# EAGLE design pcb (EAGLE 9.6.2)
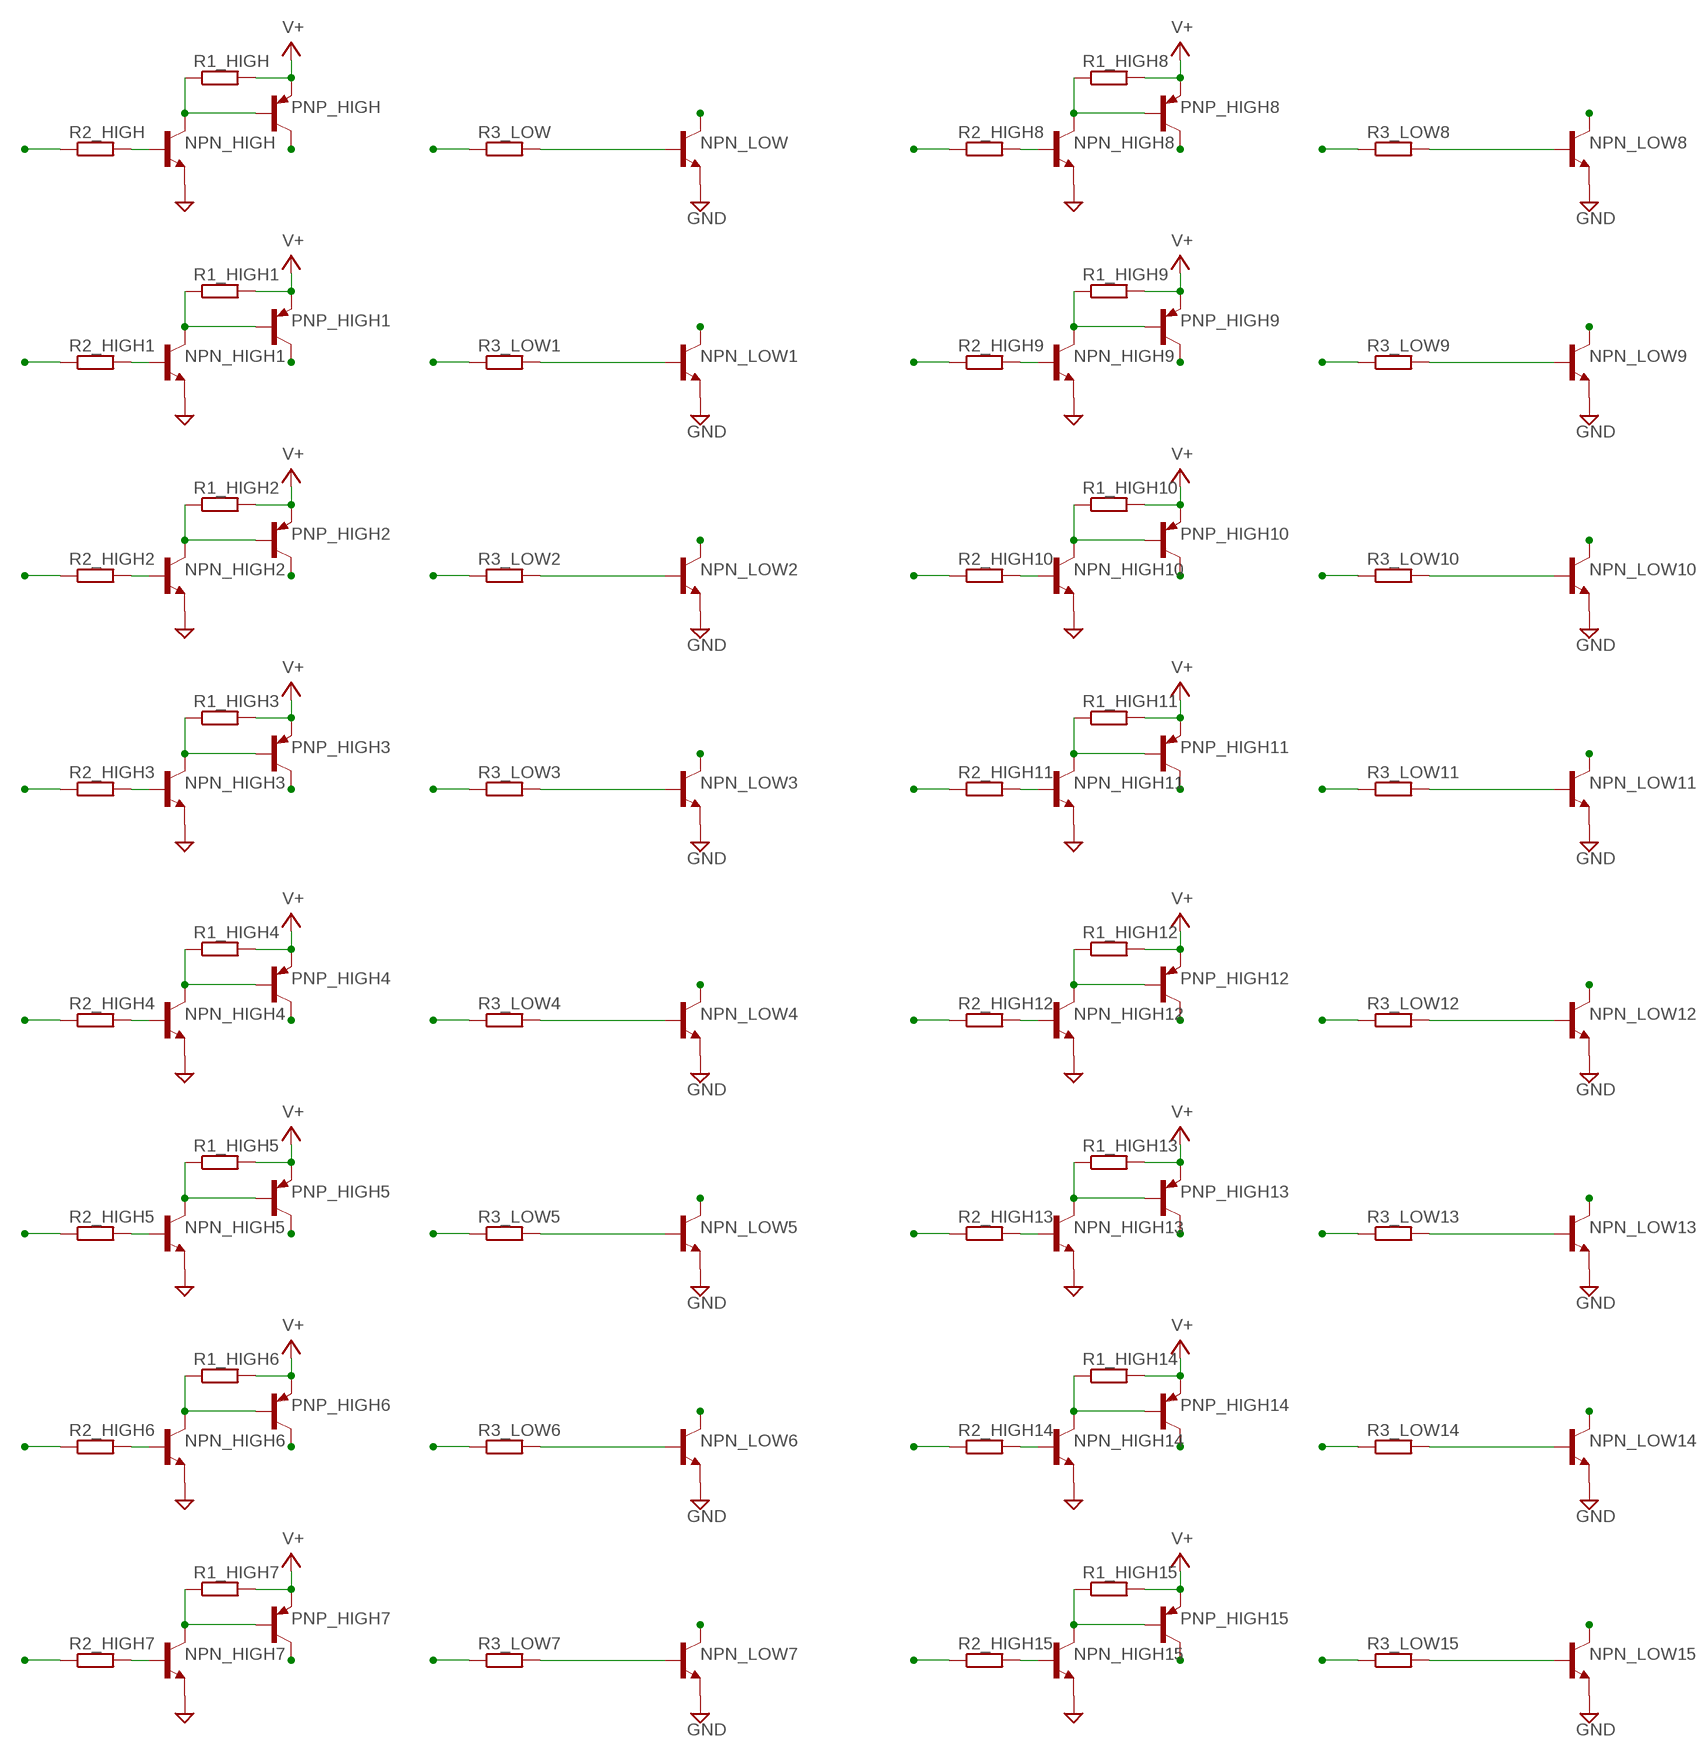
[diagram p0: schematic, sheet 1]

## Parts
NPN_HIGH  -NPN-TO92-ECB  [TO92-ECB]
NPN_HIGH1  -NPN-TO92-ECB  [TO92-ECB]
NPN_HIGH2  -NPN-TO92-ECB  [TO92-ECB]
NPN_HIGH3  -NPN-TO92-ECB  [TO92-ECB]
NPN_HIGH4  -NPN-TO92-ECB  [TO92-ECB]
NPN_HIGH5  -NPN-TO92-ECB  [TO92-ECB]
NPN_HIGH6  -NPN-TO92-ECB  [TO92-ECB]
NPN_HIGH7  -NPN-TO92-ECB  [TO92-ECB]
NPN_HIGH8  -NPN-TO92-ECB  [TO92-ECB]
NPN_HIGH9  -NPN-TO92-ECB  [TO92-ECB]
NPN_HIGH10  -NPN-TO92-ECB  [TO92-ECB]
NPN_HIGH11  -NPN-TO92-ECB  [TO92-ECB]
NPN_HIGH12  -NPN-TO92-ECB  [TO92-ECB]
NPN_HIGH13  -NPN-TO92-ECB  [TO92-ECB]
NPN_HIGH14  -NPN-TO92-ECB  [TO92-ECB]
NPN_HIGH15  -NPN-TO92-ECB  [TO92-ECB]
NPN_LOW  -NPN-TO92-ECB  [TO92-ECB]
NPN_LOW1  -NPN-TO92-ECB  [TO92-ECB]
NPN_LOW2  -NPN-TO92-ECB  [TO92-ECB]
NPN_LOW3  -NPN-TO92-ECB  [TO92-ECB]
NPN_LOW4  -NPN-TO92-ECB  [TO92-ECB]
NPN_LOW5  -NPN-TO92-ECB  [TO92-ECB]
NPN_LOW6  -NPN-TO92-ECB  [TO92-ECB]
NPN_LOW7  -NPN-TO92-ECB  [TO92-ECB]
NPN_LOW8  -NPN-TO92-ECB  [TO92-ECB]
NPN_LOW9  -NPN-TO92-ECB  [TO92-ECB]
NPN_LOW10  -NPN-TO92-ECB  [TO92-ECB]
NPN_LOW11  -NPN-TO92-ECB  [TO92-ECB]
NPN_LOW12  -NPN-TO92-ECB  [TO92-ECB]
NPN_LOW13  -NPN-TO92-ECB  [TO92-ECB]
NPN_LOW14  -NPN-TO92-ECB  [TO92-ECB]
NPN_LOW15  -NPN-TO92-ECB  [TO92-ECB]
PNP_HIGH  -PNP-TO92-BEC  [TO92-BEC]
PNP_HIGH1  -PNP-TO92-BEC  [TO92-BEC]
PNP_HIGH2  -PNP-TO92-BEC  [TO92-BEC]
PNP_HIGH3  -PNP-TO92-BEC  [TO92-BEC]
PNP_HIGH4  -PNP-TO92-BEC  [TO92-BEC]
PNP_HIGH5  -PNP-TO92-BEC  [TO92-BEC]
PNP_HIGH6  -PNP-TO92-BEC  [TO92-BEC]
PNP_HIGH7  -PNP-TO92-BEC  [TO92-BEC]
PNP_HIGH8  -PNP-TO92-BEC  [TO92-BEC]
PNP_HIGH9  -PNP-TO92-BEC  [TO92-BEC]
PNP_HIGH10  -PNP-TO92-BEC  [TO92-BEC]
PNP_HIGH11  -PNP-TO92-BEC  [TO92-BEC]
PNP_HIGH12  -PNP-TO92-BEC  [TO92-BEC]
PNP_HIGH13  -PNP-TO92-BEC  [TO92-BEC]
PNP_HIGH14  -PNP-TO92-BEC  [TO92-BEC]
PNP_HIGH15  -PNP-TO92-BEC  [TO92-BEC]
R1_HIGH  R-EU_0613/15  [P0613/15]
R1_HIGH1  R-EU_0613/15  [P0613/15]
R1_HIGH2  R-EU_0613/15  [P0613/15]
R1_HIGH3  R-EU_0613/15  [P0613/15]
R1_HIGH4  R-EU_0613/15  [P0613/15]
R1_HIGH5  R-EU_0613/15  [P0613/15]
R1_HIGH6  R-EU_0613/15  [P0613/15]
R1_HIGH7  R-EU_0613/15  [P0613/15]
R1_HIGH8  R-EU_0613/15  [P0613/15]
R1_HIGH9  R-EU_0613/15  [P0613/15]
R1_HIGH10  R-EU_0613/15  [P0613/15]
R1_HIGH11  R-EU_0613/15  [P0613/15]
R1_HIGH12  R-EU_0613/15  [P0613/15]
R1_HIGH13  R-EU_0613/15  [P0613/15]
R1_HIGH14  R-EU_0613/15  [P0613/15]
R1_HIGH15  R-EU_0613/15  [P0613/15]
R2_HIGH  R-EU_0613/15  [P0613/15]
R2_HIGH1  R-EU_0613/15  [P0613/15]
R2_HIGH2  R-EU_0613/15  [P0613/15]
R2_HIGH3  R-EU_0613/15  [P0613/15]
R2_HIGH4  R-EU_0613/15  [P0613/15]
R2_HIGH5  R-EU_0613/15  [P0613/15]
R2_HIGH6  R-EU_0613/15  [P0613/15]
R2_HIGH7  R-EU_0613/15  [P0613/15]
R2_HIGH8  R-EU_0613/15  [P0613/15]
R2_HIGH9  R-EU_0613/15  [P0613/15]
R2_HIGH10  R-EU_0613/15  [P0613/15]
R2_HIGH11  R-EU_0613/15  [P0613/15]
R2_HIGH12  R-EU_0613/15  [P0613/15]
R2_HIGH13  R-EU_0613/15  [P0613/15]
R2_HIGH14  R-EU_0613/15  [P0613/15]
R2_HIGH15  R-EU_0613/15  [P0613/15]
R3_LOW  R-EU_0613/15  [P0613/15]
R3_LOW1  R-EU_0613/15  [P0613/15]
R3_LOW2  R-EU_0613/15  [P0613/15]
R3_LOW3  R-EU_0613/15  [P0613/15]
R3_LOW4  R-EU_0613/15  [P0613/15]
R3_LOW5  R-EU_0613/15  [P0613/15]
R3_LOW6  R-EU_0613/15  [P0613/15]
R3_LOW7  R-EU_0613/15  [P0613/15]
R3_LOW8  R-EU_0613/15  [P0613/15]
R3_LOW9  R-EU_0613/15  [P0613/15]
R3_LOW10  R-EU_0613/15  [P0613/15]
R3_LOW11  R-EU_0613/15  [P0613/15]
R3_LOW12  R-EU_0613/15  [P0613/15]
R3_LOW13  R-EU_0613/15  [P0613/15]
R3_LOW14  R-EU_0613/15  [P0613/15]
R3_LOW15  R-EU_0613/15  [P0613/15]

## Nets
GND: NPN_HIGH1.E NPN_HIGH2.E NPN_HIGH3.E NPN_HIGH4.E NPN_HIGH5.E NPN_HIGH6.E NPN_HIGH7.E NPN_HIGH8.E NPN_HIGH9.E NPN_HIGH10.E NPN_HIGH11.E NPN_HIGH12.E NPN_HIGH13.E NPN_HIGH14.E NPN_HIGH15.E NPN_HIGH.E NPN_LOW1.E NPN_LOW2.E NPN_LOW3.E NPN_LOW4.E NPN_LOW5.E NPN_LOW6.E NPN_LOW7.E NPN_LOW8.E NPN_LOW9.E NPN_LOW10.E NPN_LOW11.E NPN_LOW12.E NPN_LOW13.E NPN_LOW14.E NPN_LOW15.E NPN_LOW.E
N$1: R2_HIGH.1
N$2: NPN_HIGH.B R2_HIGH.2
N$3: NPN_HIGH.C PNP_HIGH.B R1_HIGH.1
N$4: PNP_HIGH.C
N$5: NPN_LOW.B R3_LOW.2
N$6: NPN_LOW.C
N$7: R3_LOW.1
N$8: R2_HIGH1.1
N$9: NPN_HIGH1.B R2_HIGH1.2
N$10: NPN_HIGH1.C PNP_HIGH1.B R1_HIGH1.1
N$11: PNP_HIGH1.C
N$12: NPN_LOW1.B R3_LOW1.2
N$13: R3_LOW1.1
N$14: NPN_LOW1.C
N$15: R2_HIGH2.1
N$16: NPN_HIGH2.B R2_HIGH2.2
N$17: NPN_HIGH2.C PNP_HIGH2.B R1_HIGH2.1
N$18: PNP_HIGH2.C
N$19: NPN_LOW2.B R3_LOW2.2
N$20: R3_LOW2.1
N$21: NPN_LOW2.C
N$22: R2_HIGH3.1
N$23: NPN_HIGH3.B R2_HIGH3.2
N$24: NPN_HIGH3.C PNP_HIGH3.B R1_HIGH3.1
N$25: PNP_HIGH3.C
N$26: NPN_LOW3.B R3_LOW3.2
N$27: R3_LOW3.1
N$28: NPN_LOW3.C
N$29: R2_HIGH4.1
N$30: NPN_HIGH4.B R2_HIGH4.2
N$31: NPN_HIGH4.C PNP_HIGH4.B R1_HIGH4.1
N$32: PNP_HIGH4.C
N$33: NPN_LOW4.B R3_LOW4.2
N$34: R3_LOW4.1
N$35: NPN_LOW4.C
N$36: R2_HIGH5.1
N$37: NPN_HIGH5.B R2_HIGH5.2
N$38: NPN_HIGH5.C PNP_HIGH5.B R1_HIGH5.1
N$39: PNP_HIGH5.C
N$40: NPN_LOW5.B R3_LOW5.2
N$41: R3_LOW5.1
N$42: NPN_LOW5.C
N$43: R2_HIGH6.1
N$44: NPN_HIGH6.B R2_HIGH6.2
N$45: NPN_HIGH6.C PNP_HIGH6.B R1_HIGH6.1
N$46: PNP_HIGH6.C
N$47: NPN_LOW6.B R3_LOW6.2
N$48: R3_LOW6.1
N$49: NPN_LOW6.C
N$50: R2_HIGH7.1
N$51: NPN_HIGH7.B R2_HIGH7.2
N$52: NPN_HIGH7.C PNP_HIGH7.B R1_HIGH7.1
N$53: PNP_HIGH7.C
N$54: NPN_LOW7.B R3_LOW7.2
N$55: R3_LOW7.1
N$56: NPN_LOW7.C
N$57: R2_HIGH8.1
N$58: NPN_HIGH8.B R2_HIGH8.2
N$59: NPN_HIGH8.C PNP_HIGH8.B R1_HIGH8.1
N$60: PNP_HIGH8.C
N$61: NPN_LOW8.B R3_LOW8.2
N$62: R3_LOW8.1
N$63: NPN_LOW8.C
N$64: R2_HIGH9.1
N$65: NPN_HIGH9.B R2_HIGH9.2
N$66: NPN_HIGH9.C PNP_HIGH9.B R1_HIGH9.1
N$67: PNP_HIGH9.C
N$68: NPN_LOW9.B R3_LOW9.2
N$69: R3_LOW9.1
N$70: NPN_LOW9.C
N$71: R2_HIGH10.1
N$72: NPN_HIGH10.B R2_HIGH10.2
N$73: NPN_HIGH10.C PNP_HIGH10.B R1_HIGH10.1
N$74: PNP_HIGH10.C
N$75: NPN_LOW10.B R3_LOW10.2
N$76: R3_LOW10.1
N$77: NPN_LOW10.C
N$78: R2_HIGH11.1
N$79: NPN_HIGH11.B R2_HIGH11.2
N$80: NPN_HIGH11.C PNP_HIGH11.B R1_HIGH11.1
N$81: PNP_HIGH11.C
N$82: NPN_LOW11.B R3_LOW11.2
N$83: R3_LOW11.1
N$84: NPN_LOW11.C
N$85: R2_HIGH12.1
N$86: NPN_HIGH12.B R2_HIGH12.2
N$87: NPN_HIGH12.C PNP_HIGH12.B R1_HIGH12.1
N$88: PNP_HIGH12.C
N$89: NPN_LOW12.B R3_LOW12.2
N$90: R3_LOW12.1
N$91: NPN_LOW12.C
N$92: R2_HIGH13.1
N$93: NPN_HIGH13.B R2_HIGH13.2
N$94: NPN_HIGH13.C PNP_HIGH13.B R1_HIGH13.1
N$95: PNP_HIGH13.C
N$96: NPN_LOW13.B R3_LOW13.2
N$97: R3_LOW13.1
N$98: NPN_LOW13.C
N$99: R2_HIGH14.1
N$100: NPN_HIGH14.B R2_HIGH14.2
N$101: NPN_HIGH14.C PNP_HIGH14.B R1_HIGH14.1
N$102: PNP_HIGH14.C
N$103: NPN_LOW14.B R3_LOW14.2
N$104: R3_LOW14.1
N$105: NPN_LOW14.C
N$106: R2_HIGH15.1
N$107: NPN_HIGH15.B R2_HIGH15.2
N$108: NPN_HIGH15.C PNP_HIGH15.B R1_HIGH15.1
N$109: PNP_HIGH15.C
N$110: NPN_LOW15.B R3_LOW15.2
N$111: R3_LOW15.1
N$112: NPN_LOW15.C
V+: PNP_HIGH1.E PNP_HIGH2.E PNP_HIGH3.E PNP_HIGH4.E PNP_HIGH5.E PNP_HIGH6.E PNP_HIGH7.E PNP_HIGH8.E PNP_HIGH9.E PNP_HIGH10.E PNP_HIGH11.E PNP_HIGH12.E PNP_HIGH13.E PNP_HIGH14.E PNP_HIGH15.E PNP_HIGH.E R1_HIGH1.2 R1_HIGH2.2 R1_HIGH3.2 R1_HIGH4.2 R1_HIGH5.2 R1_HIGH6.2 R1_HIGH7.2 R1_HIGH8.2 R1_HIGH9.2 R1_HIGH10.2 R1_HIGH11.2 R1_HIGH12.2 R1_HIGH13.2 R1_HIGH14.2 R1_HIGH15.2 R1_HIGH.2

## Library data of the parts
NPN_HIGH NPN_HIGH1-NPN_HIGH15 NPN_LOW NPN_LOW1-NPN_LOW15 = transistor:*-NPN-: NPN Transistror BF959 corrected 2008.03.06
PNP_HIGH PNP_HIGH1-PNP_HIGH15 = transistor:*-PNP-: PNP Transistror
R1_HIGH R1_HIGH1-R1_HIGH15 R2_HIGH R2_HIGH1-R2_HIGH15 R3_LOW R3_LOW1-R3_LOW15 = rcl:R-EU_: RESISTOR, European symbol; SPICEPREFIX: R

## Board
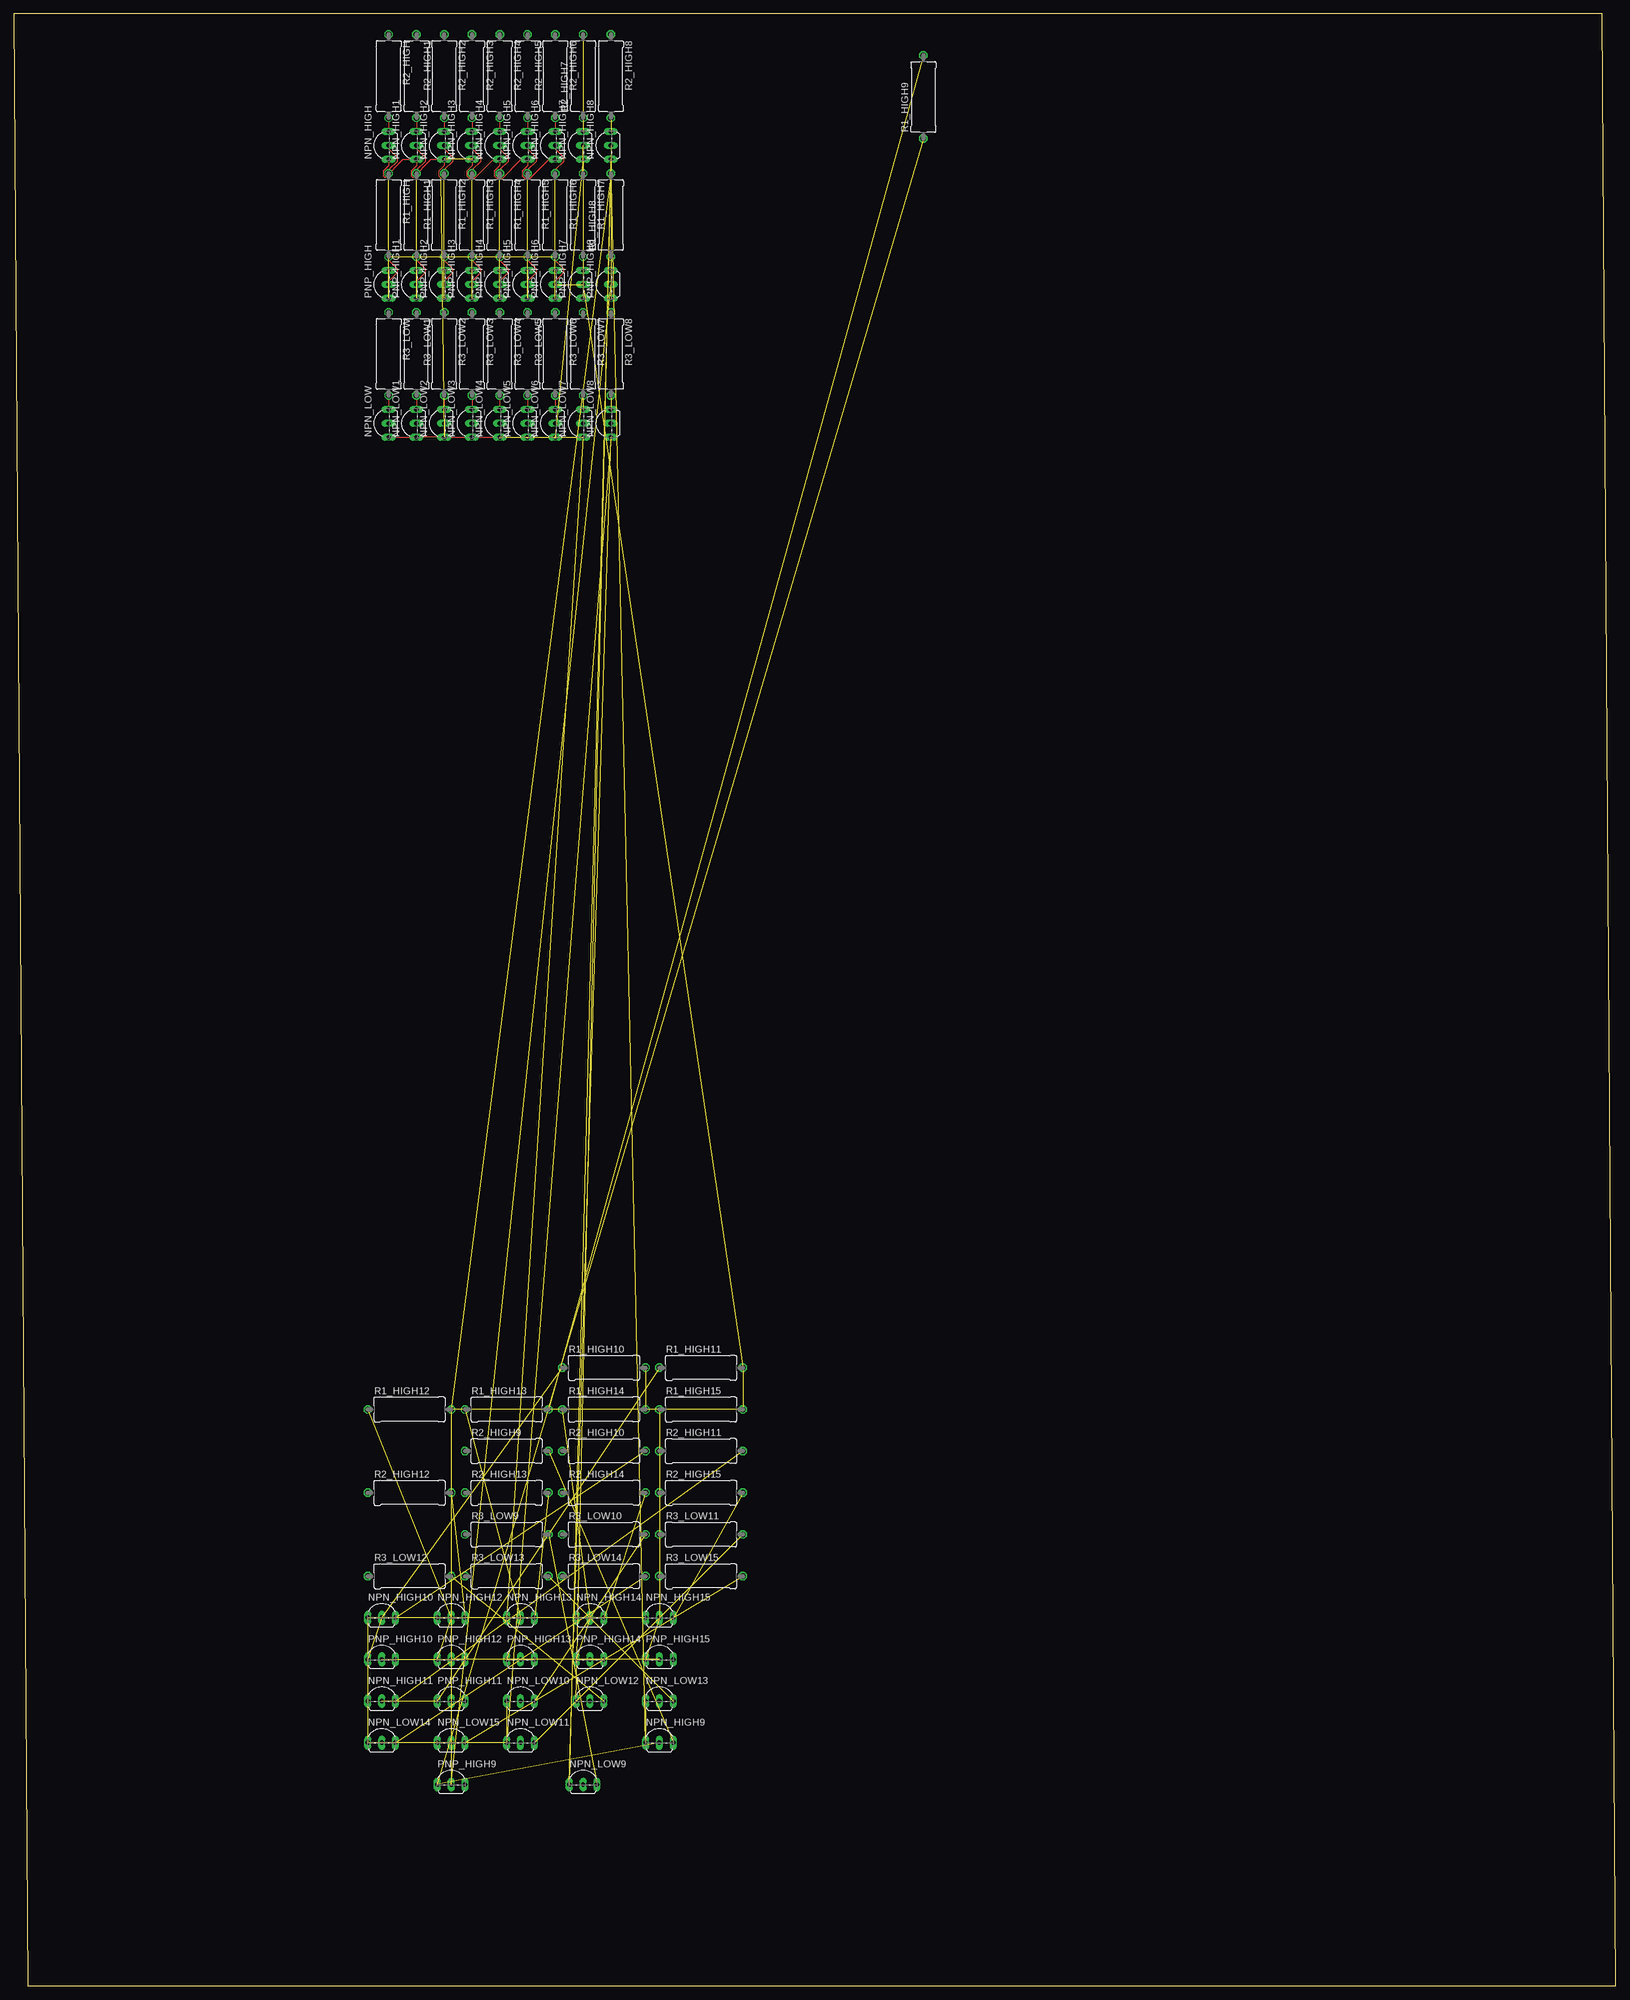
[diagram p1: board, top side]

Size 293.04 x 360.67 mm. Coordinates in mm from the lower left corner, seen from the top.
Outline: 2.54,0 293.04,0 290.5,360.67 0,360.67 2.54,0
Copper layers (1*16): Top 0.035mm / dielectric 1.5mm / Bottom 0.035mm
Design rules "default": minimum track width 6mil, minimum drill 0.35mm, track to track 6mil, track to pad 6mil, pad to pad 6mil, via to via 6mil, smd to smd 6mil, copper to edge 40mil, drill to drill 6mil, minimum pad ring 10mil, minimum via ring 8mil, stop-mask expansion 4mil, vias tented up to drill 0mil, thermal gap 10mil

### Footprints (pad centres in the part's own frame; a part is rotated, then mirrored left to right if it is on the bottom)
TO92-ECB = drill 0.813 long: B 2.54,0; C 0,0; E -2.54,0
TO92-BEC = drill 0.813 long: B -2.54,0; C 2.54,0; E 0,0
P0613/15 = drill 1.016 octagon: 1 -7.62,0; 2 7.62,0

### Placement (x,y rotation side)
NPN_HIGH  68.58,336.55 90 top
NPN_HIGH1  73.66,336.55 90 top
NPN_HIGH2  78.74,336.55 90 top
NPN_HIGH3  83.82,336.55 90 top
NPN_HIGH4  88.9,336.55 90 top
NPN_HIGH5  93.98,336.55 90 top
NPN_HIGH6  99.06,336.55 90 top
NPN_HIGH7  104.14,336.55 90 top
NPN_HIGH8  109.22,336.55 90 top
NPN_HIGH9  118.11,44.45 0 top
NPN_HIGH10  67.31,67.31 0 top
NPN_HIGH11  67.31,52.07 0 top
NPN_HIGH12  80.01,67.31 0 top
NPN_HIGH13  92.71,67.31 0 top
NPN_HIGH14  105.41,67.31 0 top
NPN_HIGH15  118.11,67.31 0 top
NPN_LOW  68.58,285.75 90 top
NPN_LOW1  73.66,285.75 90 top
NPN_LOW2  78.74,285.75 90 top
NPN_LOW3  83.82,285.75 90 top
NPN_LOW4  88.9,285.75 90 top
NPN_LOW5  93.98,285.75 90 top
NPN_LOW6  99.06,285.75 90 top
NPN_LOW7  104.14,285.75 90 top
NPN_LOW8  109.22,285.75 90 top
NPN_LOW9  104.14,36.83 0 top
NPN_LOW10  92.71,52.07 0 top
NPN_LOW11  92.71,44.45 0 top
NPN_LOW12  105.41,52.07 0 top
NPN_LOW13  118.11,52.07 0 top
NPN_LOW14  67.31,44.45 0 top
NPN_LOW15  80.01,44.45 0 top
PNP_HIGH  68.58,311.15 90 top
PNP_HIGH1  73.66,311.15 90 top
PNP_HIGH2  78.74,311.15 90 top
PNP_HIGH3  83.82,311.15 90 top
PNP_HIGH4  88.9,311.15 90 top
PNP_HIGH5  93.98,311.15 90 top
PNP_HIGH6  99.06,311.15 90 top
PNP_HIGH7  104.14,311.15 90 top
PNP_HIGH8  109.22,311.15 90 top
PNP_HIGH9  80.01,36.83 0 top
PNP_HIGH10  67.31,59.69 0 top
PNP_HIGH11  80.01,52.07 0 top
PNP_HIGH12  80.01,59.69 0 top
PNP_HIGH13  92.71,59.69 0 top
PNP_HIGH14  105.41,59.69 0 top
PNP_HIGH15  118.11,59.69 0 top
R1_HIGH  68.58,323.85 270 top
R1_HIGH1  73.66,323.85 270 top
R1_HIGH2  78.74,323.85 270 top
R1_HIGH3  83.82,323.85 270 top
R1_HIGH4  88.9,323.85 270 top
R1_HIGH5  93.98,323.85 270 top
R1_HIGH6  99.06,323.85 270 top
R1_HIGH7  104.14,323.85 270 top
R1_HIGH8  109.22,323.85 90 top
R1_HIGH9  166.37,345.44 90 top
R1_HIGH10  107.95,113.03 0 top
R1_HIGH11  125.73,113.03 0 top
R1_HIGH12  72.39,105.41 0 top
R1_HIGH13  90.17,105.41 0 top
R1_HIGH14  107.95,105.41 0 top
R1_HIGH15  125.73,105.41 0 top
R2_HIGH  68.58,349.25 270 top
R2_HIGH1  73.66,349.25 270 top
R2_HIGH2  78.74,349.25 270 top
R2_HIGH3  83.82,349.25 270 top
R2_HIGH4  88.9,349.25 270 top
R2_HIGH5  93.98,349.25 270 top
R2_HIGH6  99.06,349.25 270 top
R2_HIGH7  104.14,349.25 90 top
R2_HIGH8  109.22,349.25 270 top
R2_HIGH9  90.17,97.79 0 top
R2_HIGH10  107.95,97.79 0 top
R2_HIGH11  125.73,97.79 0 top
R2_HIGH12  72.39,90.17 0 top
R2_HIGH13  90.17,90.17 0 top
R2_HIGH14  107.95,90.17 0 top
R2_HIGH15  125.73,90.17 0 top
R3_LOW  68.58,298.45 270 top
R3_LOW1  73.66,298.45 270 top
R3_LOW2  78.74,298.45 270 top
R3_LOW3  83.82,298.45 270 top
R3_LOW4  88.9,298.45 270 top
R3_LOW5  93.98,298.45 270 top
R3_LOW6  99.06,298.45 270 top
R3_LOW7  104.14,298.45 270 top
R3_LOW8  109.22,298.45 270 top
R3_LOW9  90.17,82.55 0 top
R3_LOW10  107.95,82.55 0 top
R3_LOW11  125.73,82.55 0 top
R3_LOW12  72.39,74.93 0 top
R3_LOW13  90.17,74.93 0 top
R3_LOW14  107.95,74.93 0 top
R3_LOW15  125.73,74.93 0 top

### Tracks (layer width: path | path; a pad name or v marks a point on that pad's centre or on a via)
GND  (20 unrouted)
  Top 0.152: NPN_LOW.E NPN_LOW1.E NPN_LOW2.E NPN_LOW3.E NPN_LOW4.E NPN_LOW5.E NPN_LOW6.E | NPN_HIGH.E 68.58,332.87 67.59,331.88 67.59,331.06 67.94,330.7 71.25,334.01 NPN_HIGH1.E 73.66,332.87 72.67,331.88 72.67,331.06 73.03,330.7 76.33,334.01 NPN_HIGH2.E 78.74,332.87 77.75,331.88 77.75,331.06 78.11,330.7 | NPN_HIGH3.E 83.82,332.87 82.83,331.88 82.83,331.06 83.41,330.48 84.23,330.48 87.76,334.01 NPN_HIGH4.E 88.9,332.87 87.91,331.88 87.91,331.06 88.49,330.48 89.31,330.48 92.84,334.01 NPN_HIGH5.E 93.98,332.87 92.99,331.88 92.99,331.06 93.57,330.48 94.39,330.48 97.92,334.01 NPN_HIGH6.E
N$2
  Top 0.152: R2_HIGH.2 NPN_HIGH.B
N$3  (1 unrouted)
  Top 0.152: NPN_HIGH.C 68.58,335.93 70.13,334.38 70.13,333.64 68.58,332.09 R1_HIGH.1
N$5
  Top 0.152: R3_LOW.2 NPN_LOW.B
N$9
  Top 0.152: R2_HIGH1.2 NPN_HIGH1.B
N$10  (1 unrouted)
  Top 0.152: NPN_HIGH1.C 73.66,335.93 75.21,334.38 75.21,333.64 73.66,332.09 R1_HIGH1.1
N$12
  Top 0.152: R3_LOW1.2 NPN_LOW1.B
N$16
  Top 0.152: R2_HIGH2.2 NPN_HIGH2.B
N$17  (1 unrouted)
  Top 0.152: NPN_HIGH2.C 78.74,335.93 80.29,334.38 80.29,333.64 78.74,332.09 R1_HIGH2.1
N$19
  Top 0.152: R3_LOW2.2 NPN_LOW2.B
N$23
  Top 0.152: R2_HIGH3.2 NPN_HIGH3.B
N$24  (1 unrouted)
  Top 0.152: NPN_HIGH3.C 83.82,335.93 85.37,334.38 85.37,333.64 83.82,332.09 R1_HIGH3.1
N$26
  Top 0.152: R3_LOW3.2 NPN_LOW3.B
N$30
  Top 0.152: R2_HIGH4.2 NPN_HIGH4.B
N$31  (1 unrouted)
  Top 0.152: NPN_HIGH4.C 88.9,335.93 90.45,334.38 90.45,333.64 88.9,332.09 R1_HIGH4.1
N$33
  Top 0.152: R3_LOW4.2 NPN_LOW4.B
N$37
  Top 0.152: R2_HIGH5.2 NPN_HIGH5.B
N$38  (1 unrouted)
  Top 0.152: NPN_HIGH5.C 93.98,335.93 95.53,334.38 95.53,333.64 93.98,332.09 R1_HIGH5.1
N$40
  Top 0.152: R3_LOW5.2 NPN_LOW5.B
N$44
  Top 0.152: R2_HIGH6.2 NPN_HIGH6.B
N$45  (1 unrouted)
  Top 0.152: NPN_HIGH6.C 99.06,335.93 100.61,334.38 100.61,333.64 99.06,332.09 R1_HIGH6.1
N$47
  Top 0.152: R3_LOW6.2 NPN_LOW6.B
N$51  (1 unrouted)
N$52  (2 unrouted)
N$54  (1 unrouted)
N$58  (1 unrouted)
N$59  (2 unrouted)
N$61  (1 unrouted)
N$65  (1 unrouted)
N$66  (2 unrouted)
N$68  (1 unrouted)
N$72  (1 unrouted)
N$73  (2 unrouted)
N$75  (1 unrouted)
N$79  (1 unrouted)
N$80  (2 unrouted)
N$82  (1 unrouted)
N$86  (1 unrouted)
N$87  (2 unrouted)
N$89  (1 unrouted)
N$93  (1 unrouted)
N$94  (2 unrouted)
N$96  (1 unrouted)
N$100  (1 unrouted)
N$101  (2 unrouted)
N$103  (1 unrouted)
N$107  (1 unrouted)
N$108  (2 unrouted)
N$110  (1 unrouted)
V+  (24 unrouted)
  Top 0.152: R1_HIGH.2 68.58,315.61 70.13,314.06 70.13,313.32 68.58,311.77 PNP_HIGH.E | R1_HIGH1.2 73.66,315.61 75.21,314.06 75.21,313.32 73.66,311.77 PNP_HIGH1.E | R1_HIGH2.2 78.74,315.61 80.29,314.06 80.29,313.32 78.74,311.77 PNP_HIGH2.E | R1_HIGH3.2 83.82,315.61 85.37,314.06 85.37,313.32 83.82,311.77 PNP_HIGH3.E | R1_HIGH4.2 88.9,315.61 90.45,314.06 90.45,313.32 88.9,311.77 PNP_HIGH4.E | R1_HIGH5.2 93.98,315.61 95.53,314.06 95.53,313.32 93.98,311.77 PNP_HIGH5.E | R1_HIGH6.2 99.06,315.61 100.61,314.06 100.61,313.32 99.06,311.77 PNP_HIGH6.E